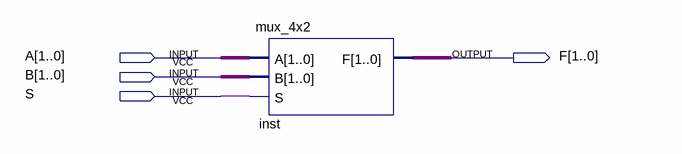
[diagram p0: schematic sheet]
// Quartus schematic main.bdf as structural Verilog: 1 symbols, 4 pins
module main (
  input  [1:0] A,
  input  [1:0] B,
  input  S,
  output [1:0] F
);

  mux_4x2 inst (.A(A), .B(B), .S(S), .F(F));
endmodule
